# EasyEDA Pro project ProPrj_ESP32 Touchpad.epro, schematic Schematic1

## Sheets
1 ESP32: Assembly Variant: Basic; Board Name: Board1; Create Date: 2025-12-21; Page Name: P1; Project Name: ESP32 Touchpad; Schematic Name: Schematic1; Update Date: 2025-12-21; BladeWidth: 10; Company: 嘉立创EDA; Page Size: A4; RegionStart: 1; ShowBorder: 1; TitleBlock: 1; TitleBlockPosition: 3; Version: V1.0; XRegionCount: 6; YRegionCount: 4
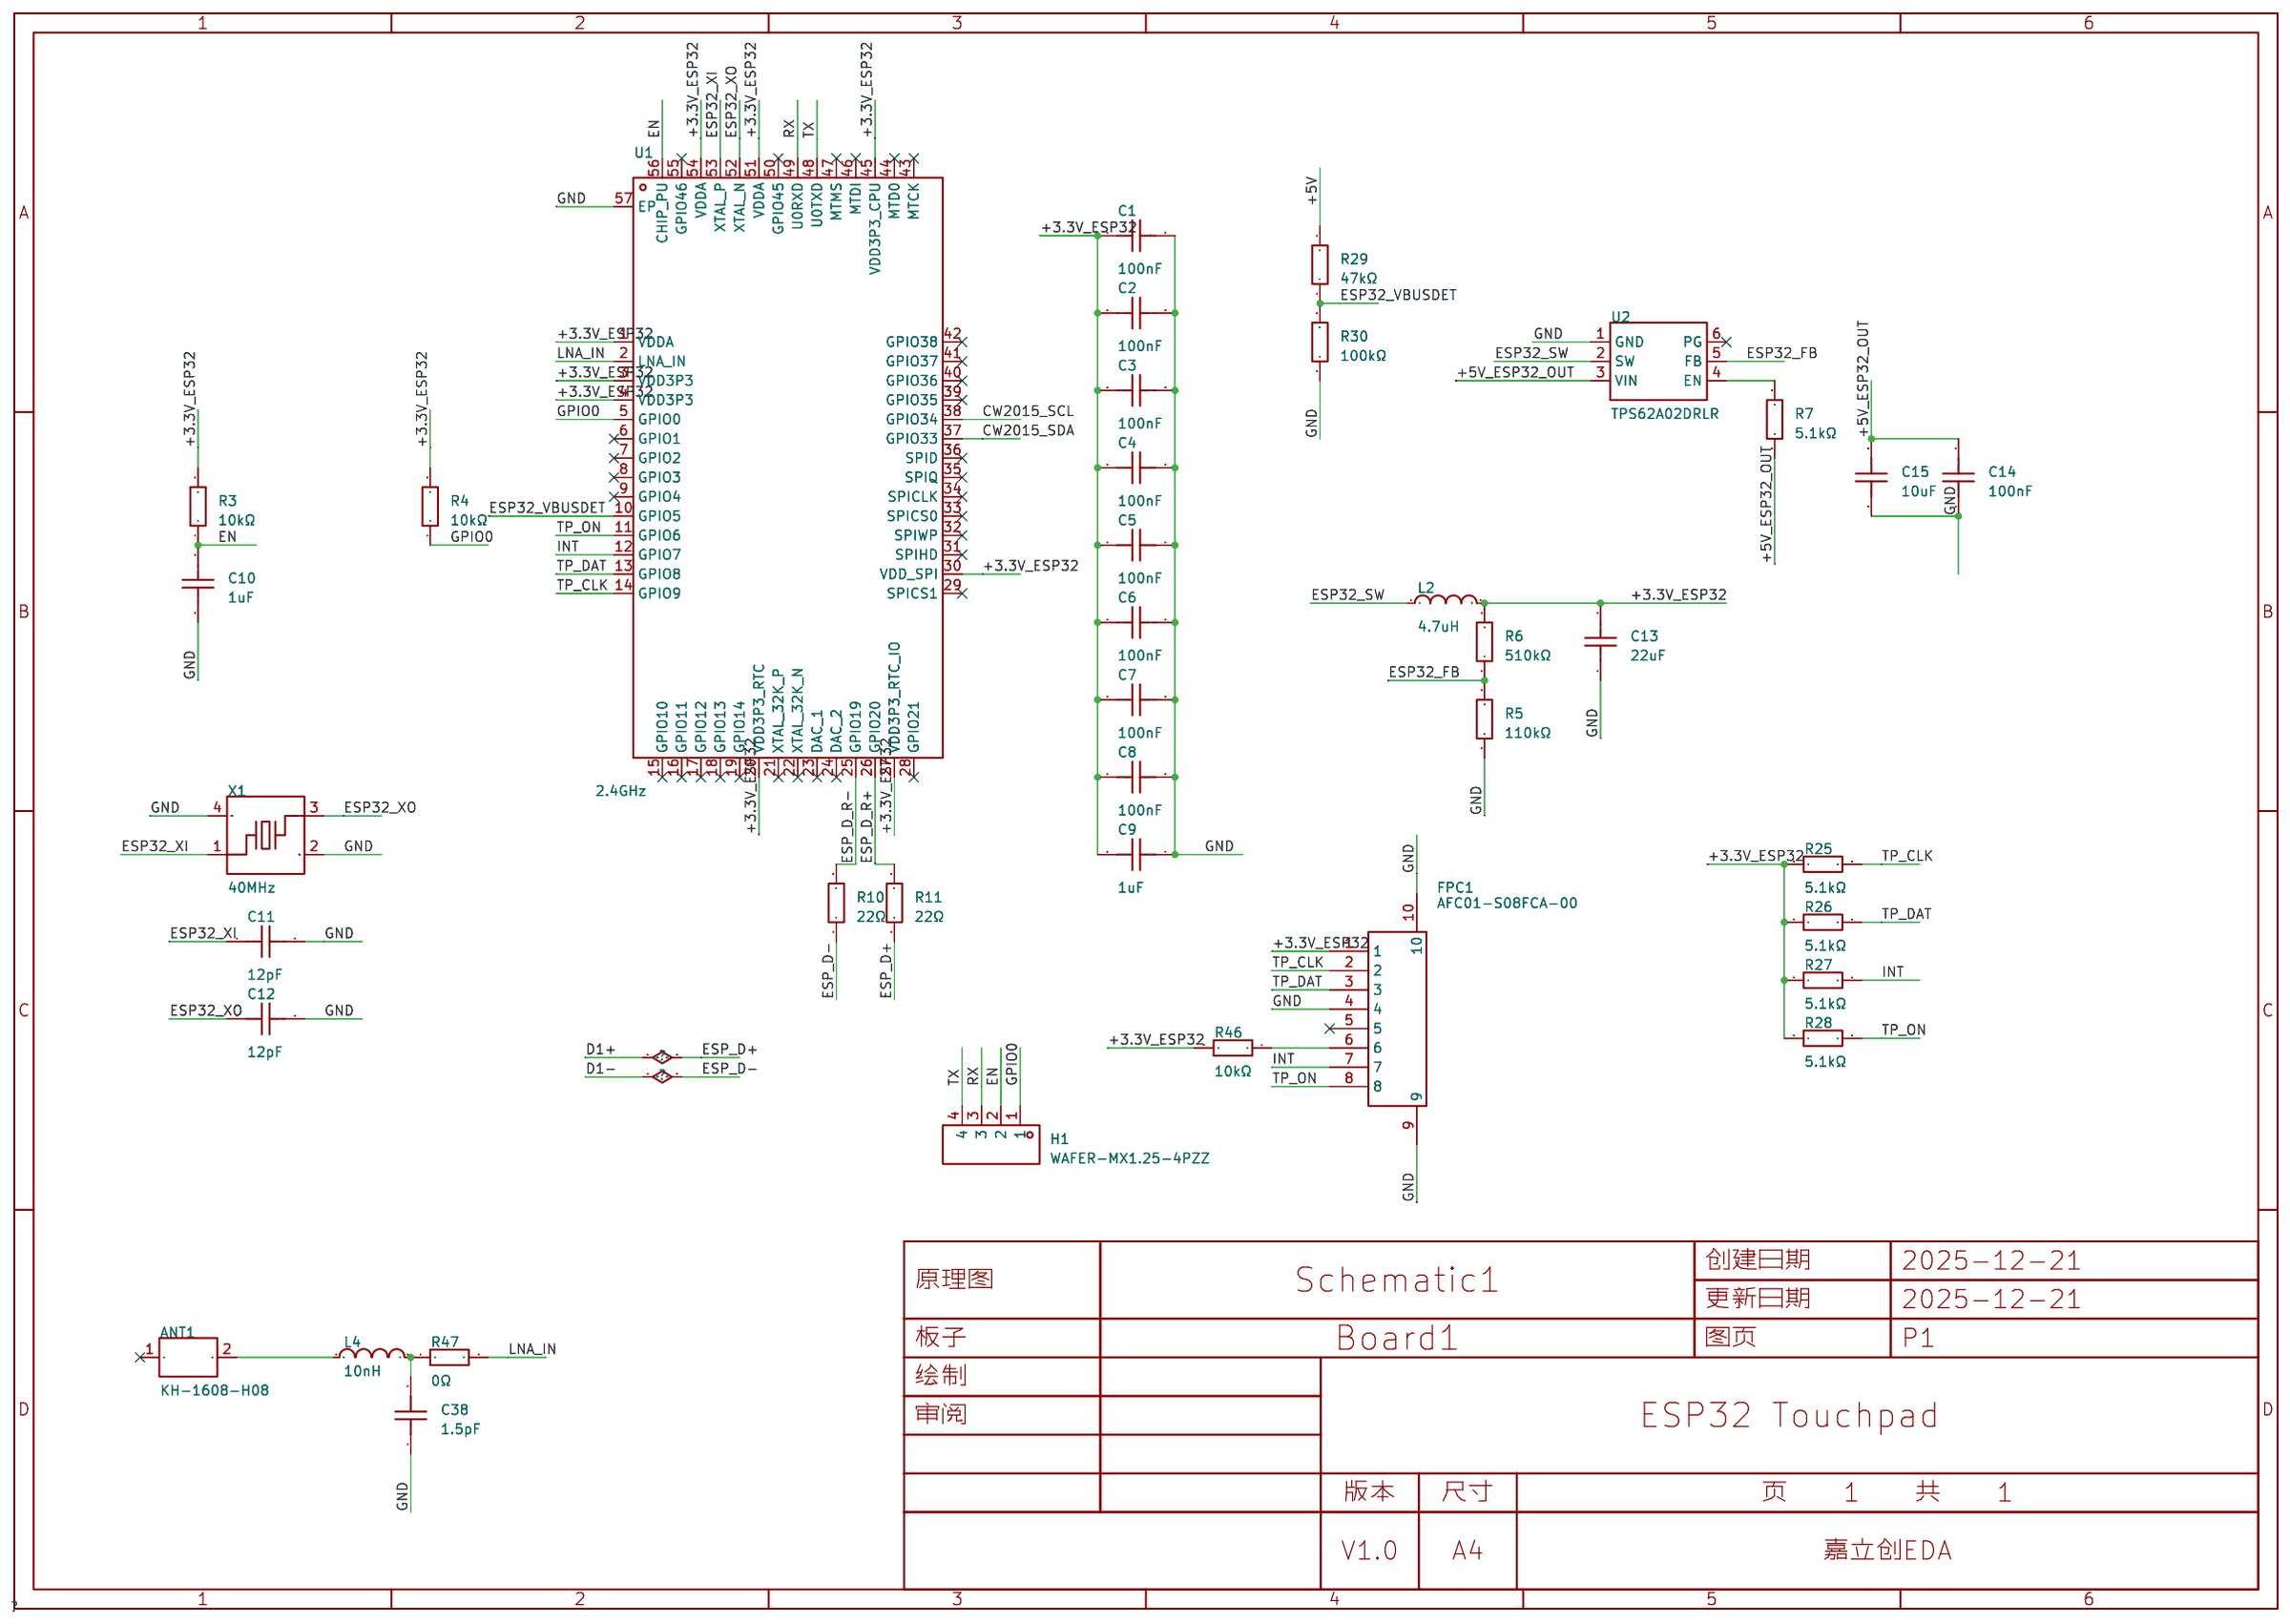
[diagram p1: ESP32]
2 BAT: Create Date: 2026-01-17; Update Date: 2026-01-17
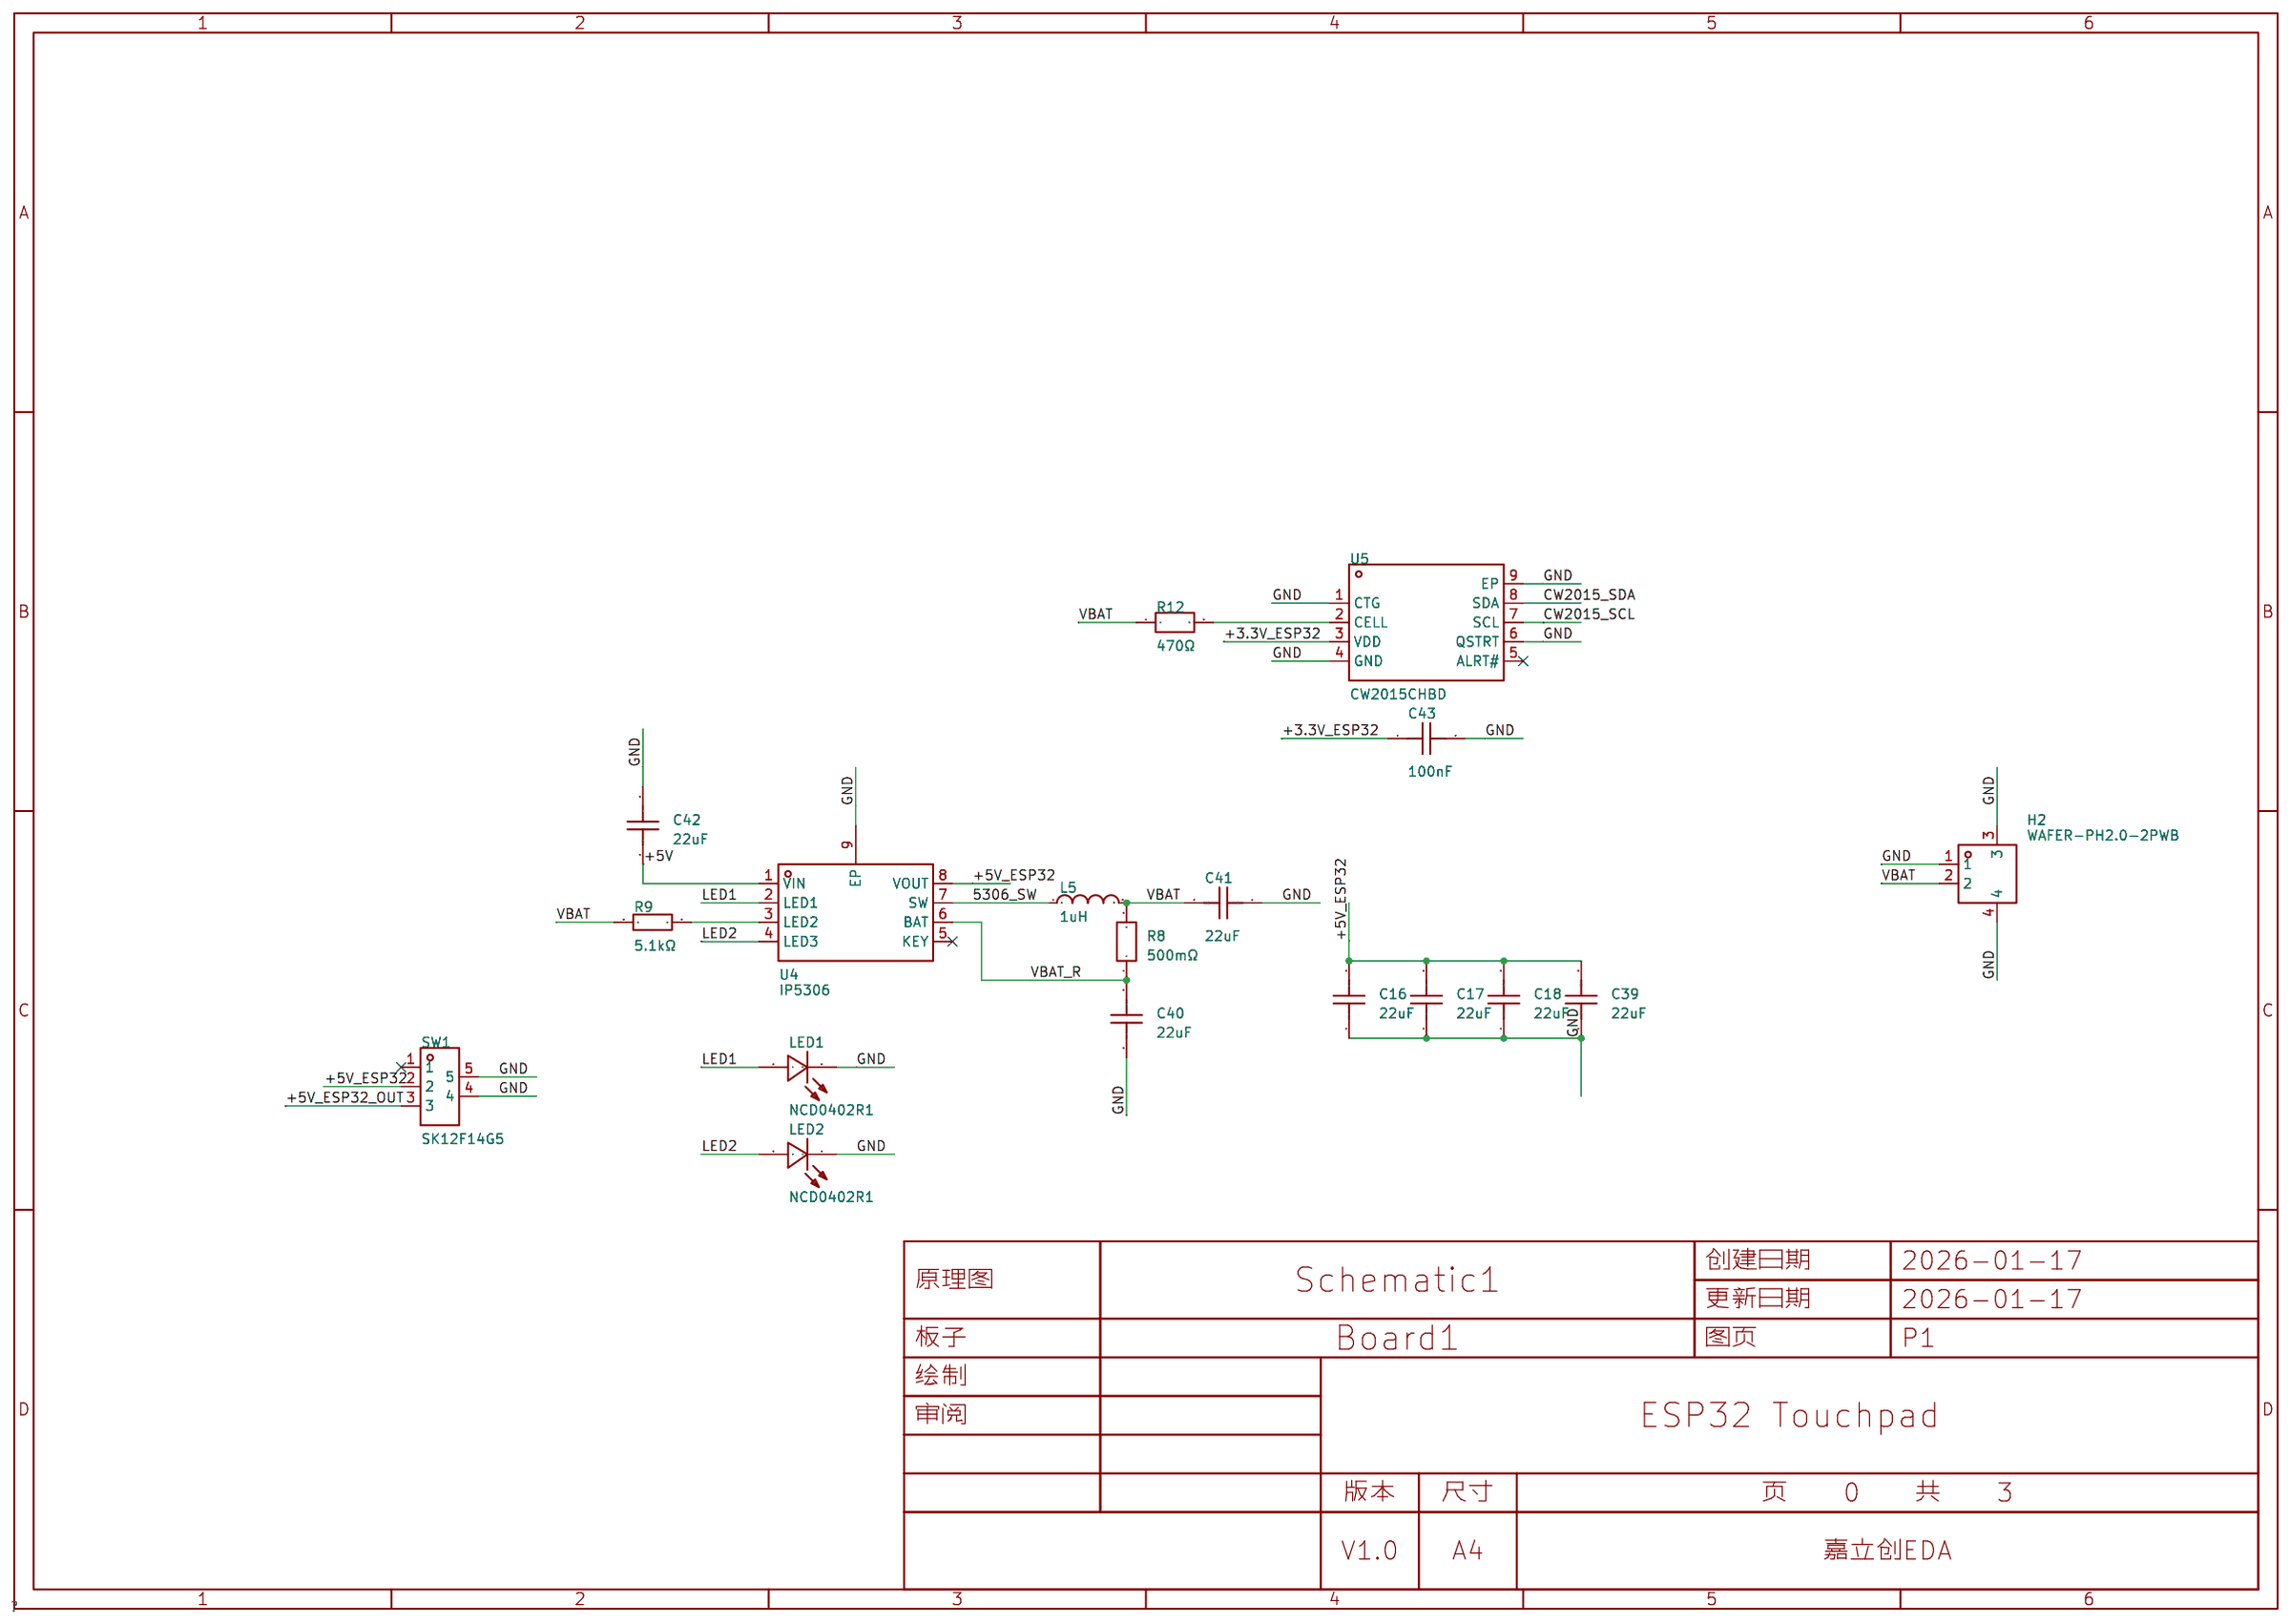
[diagram p2: BAT]
3 USB2513B: Create Date: 2025-12-22; Update Date: 2025-12-22
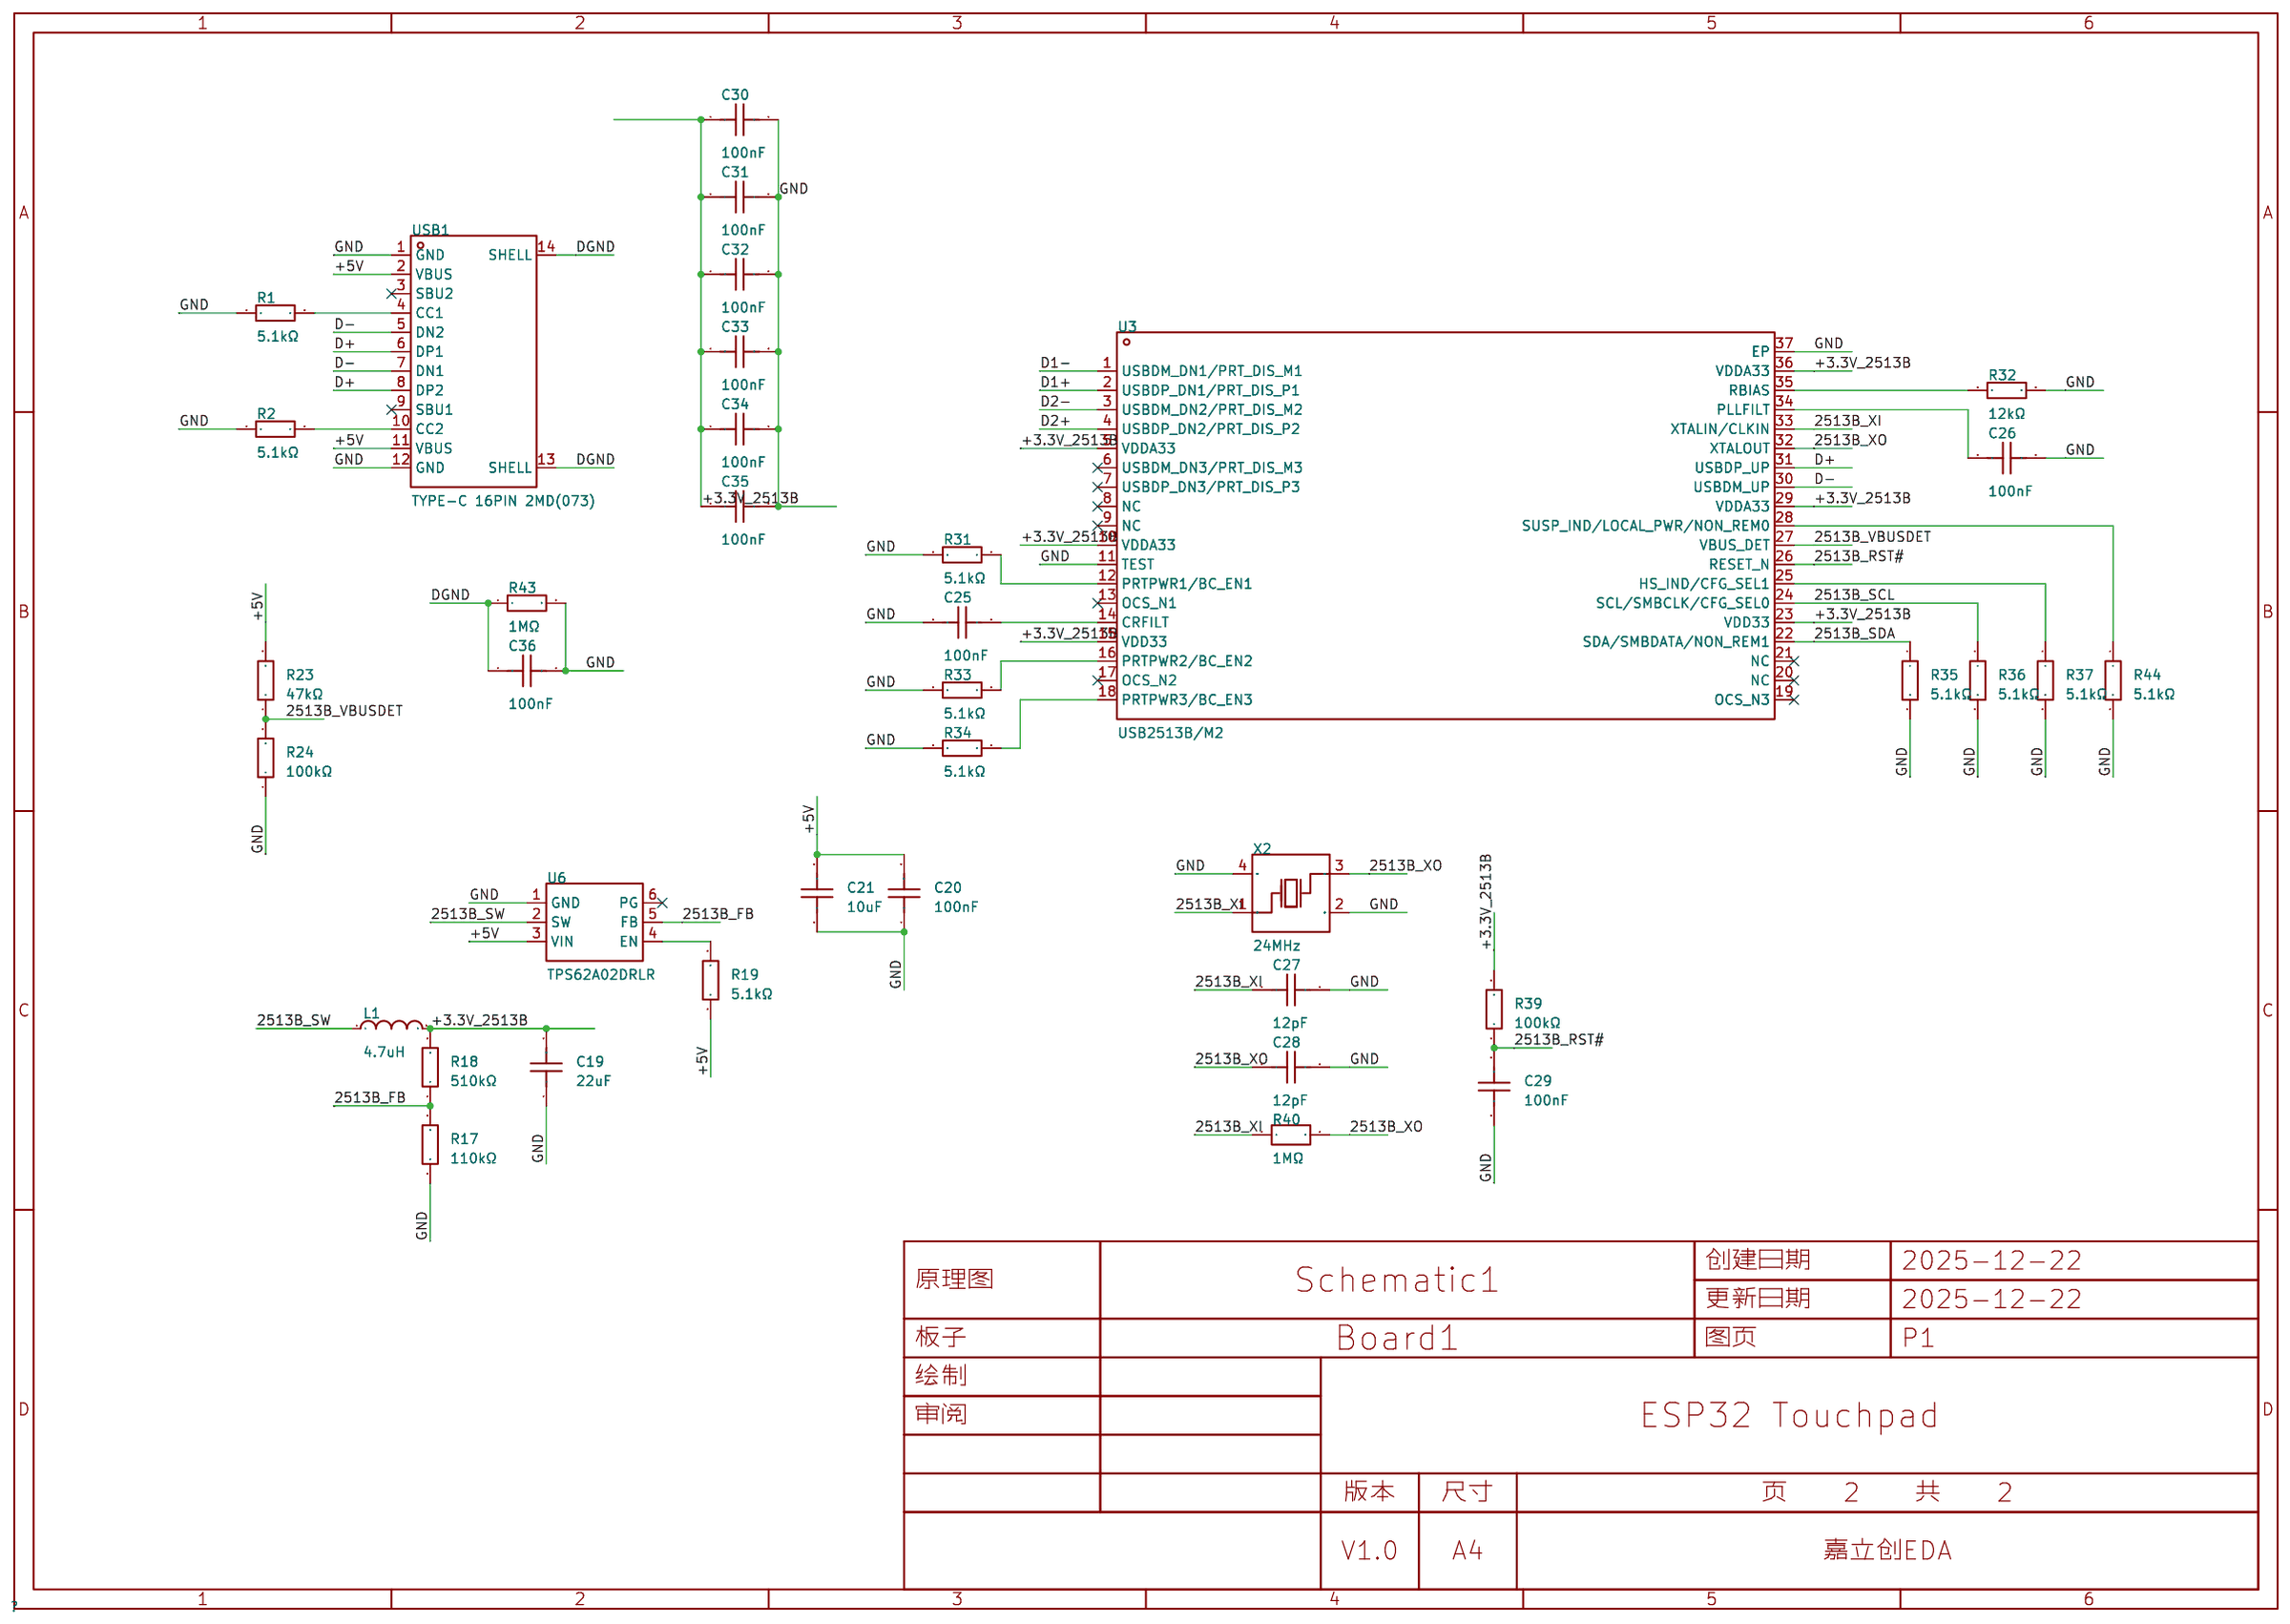
[diagram p3: USB2513B]
4 FM3483_3633: Create Date: 2025-12-22; Page Name: P2; Update Date: 2025-12-22
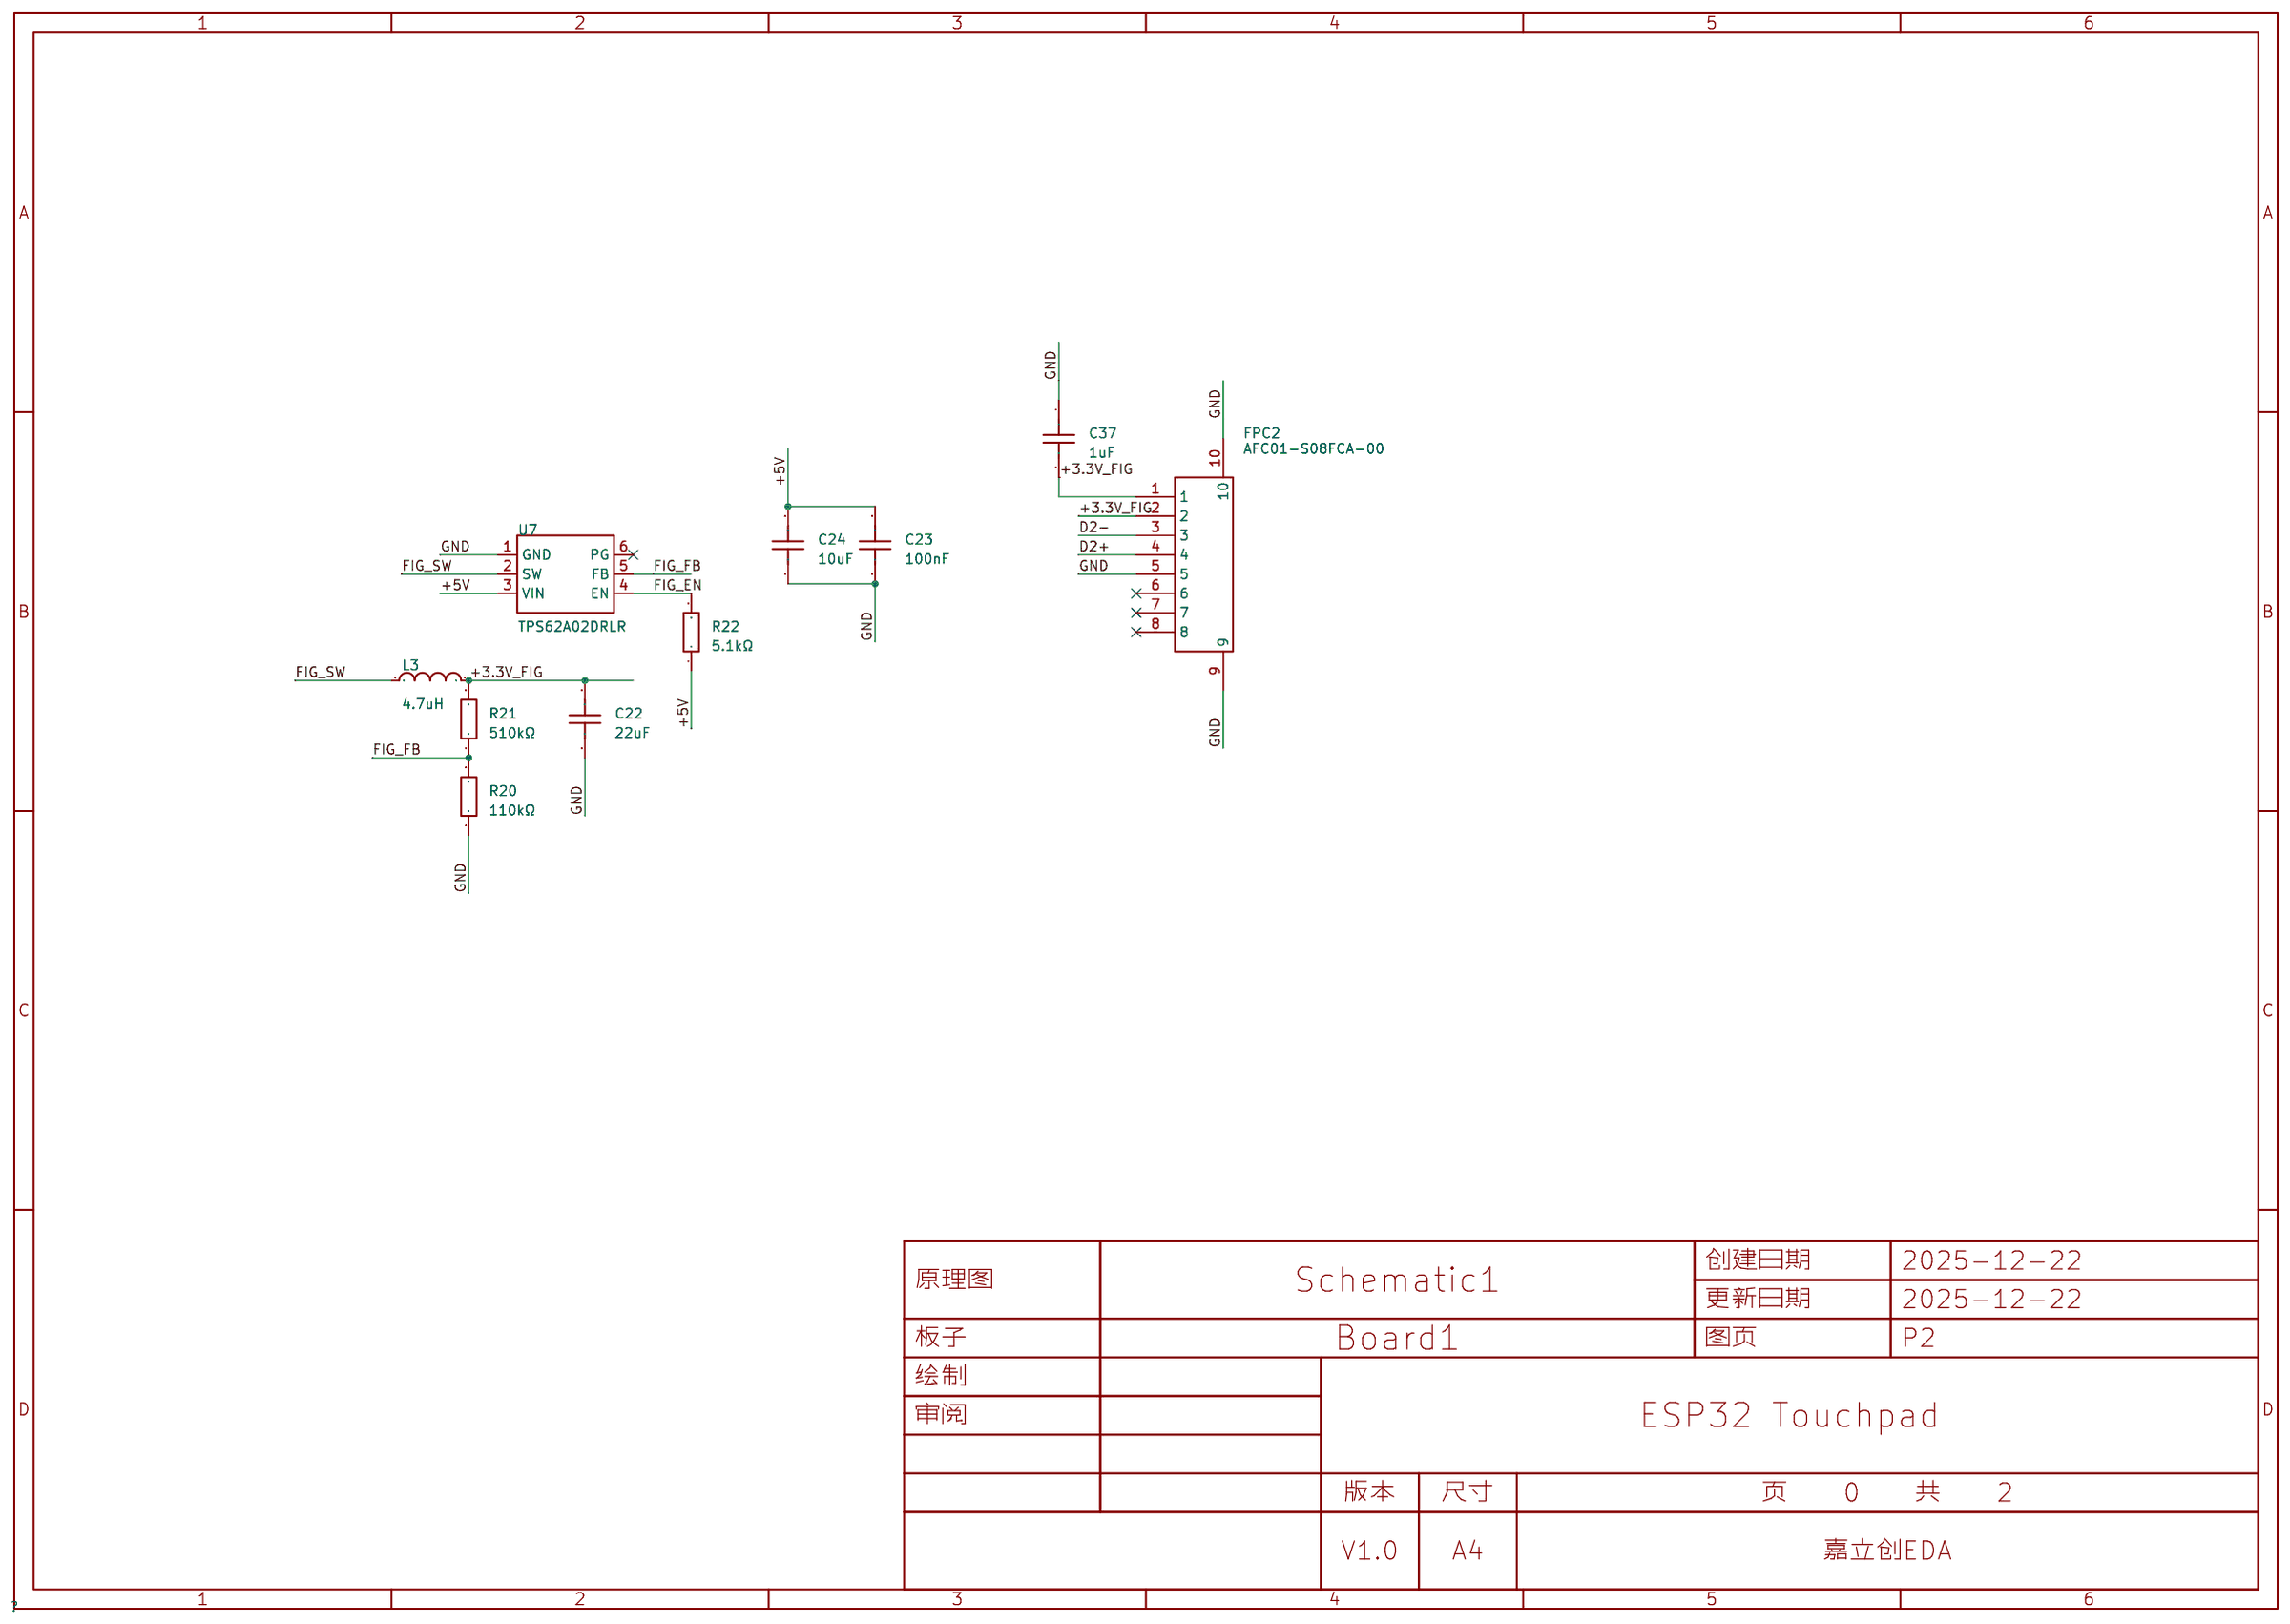
[diagram p4: FM3483_3633]

## Parts
sheet BAT
C16  22uF  [C0402]
C17  22uF  [C0402]
C18  22uF  [C0402]
C39  22uF  [C0402]
C40  22uF  [C0402]
C41  22uF  [C0402]
C42  22uF  [C0402]
C43  100nF  [C0402]
H2  WAFER-PH2.0-2PWB  [CONN-SMD_2P-P2.00_XUNPU_WAFER-PH2.0-2PWB]
L5  1uH  [IND-SMD_L2.5-W2.0-VLS252012CX-150M]
LED1  NCD0402R1  [LED0402-RD]
LED2  NCD0402R1  [LED0402-RD]
R8  500mΩ  [R0603]
R9  5.1kΩ  [R0402]
R12  470Ω  [R0402]
SW1  SK12F14G5  [SW-TH_SK12F14G5]
U4  IP5306  [ESOP-8_L4.9-W3.9-P1.27-LS6.0-BL-EP]
U5  CW2015CHBD  [TDFN-8_L3.0-W2.0-P0.50-BL-EP]
sheet ESP32
ANT1  KH-1608-H08  [ANT-SMD_L1.7-W0.9]
C1  100nF  [C0402]
C2  100nF  [C0402]
C3  100nF  [C0402]
C4  100nF  [C0402]
C5  100nF  [C0402]
C6  100nF  [C0402]
C7  100nF  [C0402]
C8  100nF  [C0402]
C9  1uF  [C0402]
C10  1uF  [C0402]
C11  12pF  [C0201]
C12  12pF  [C0201]
C13  22uF  [C0402]
C14  100nF  [C0402]
C15  10uF  [C0402]
C38  1.5pF  [C0402]
FPC1  AFC01-S08FCA-00  [FPC-SMD_P0.50-8P_FGS-XJ-H2.0]
H1  WAFER-MX1.25-4PZZ  [CONN-TH_4P-P1.25_WAFER-MX1.25-4PZZ]
L2  4.7uH  [IND-SMD_L2.5-W2.0-VLS252012CX-150M]
L4  10nH  [L0402-RD]
R3  10kΩ  [R0402]
R4  10kΩ  [R0402]
R5  110kΩ  [R0402]
R6  510kΩ  [R0402]
R7  5.1kΩ  [R0402]
R10  22Ω  [R0201]
R11  22Ω  [R0201]
R25  5.1kΩ  [R0402]
R26  5.1kΩ  [R0402]
R27  5.1kΩ  [R0402]
R28  5.1kΩ  [R0402]
R29  47kΩ  [R0402_1]
R30  100kΩ  [R0402_1]
R46  10kΩ  [R0402]
R47  0Ω  [R0402_1]
U1  2.4GHz  [QFN-56_L7.0-W7.0-P0.40-TL-EP4.6]
U2  TPS62A02DRLR  [SOT-563_L1.6-W1.2-P0.50-LS1.6-TL]
X1  40MHz  [CRYSTAL-SMD_4P-L1.6-W1.2-BL]
sheet FM3483_3633
C22  22uF  [C0402]
C23  100nF  [C0402]
C24  10uF  [C0402]
C37  1uF  [C0402]
FPC2  AFC01-S08FCA-00  [FPC-SMD_P0.50-8P_FGS-XJ-H2.0]
L3  4.7uH  [IND-SMD_L2.5-W2.0-VLS252012CX-150M]
R20  110kΩ  [R0402]
R21  510kΩ  [R0402]
R22  5.1kΩ  [R0402]
U7  TPS62A02DRLR  [SOT-563_L1.6-W1.2-P0.50-LS1.6-TL]
sheet USB2513B
C19  22uF  [C0402]
C20  100nF  [C0402]
C21  10uF  [C0402]
C25  100nF  [C0402]
C26  100nF  [C0402]
C27  12pF  [C0201]
C28  12pF  [C0201]
C29  100nF  [C0402]
C30  100nF  [C0402]
C31  100nF  [C0402]
C32  100nF  [C0402]
C33  100nF  [C0402]
C34  100nF  [C0402]
C35  100nF  [C0402]
C36  100nF  [C0805]
L1  4.7uH  [IND-SMD_L2.5-W2.0-VLS252012CX-150M]
R1  5.1kΩ  [R0402]
R2  5.1kΩ  [R0402]
R17  110kΩ  [R0402]
R18  510kΩ  [R0402]
R19  5.1kΩ  [R0402]
R23  47kΩ  [R0402_1]
R24  100kΩ  [R0402_1]
R31  5.1kΩ  [R0402]
R32  12kΩ  [R0402]
R33  5.1kΩ  [R0402]
R34  5.1kΩ  [R0402]
R35  5.1kΩ  [R0402]
R36  5.1kΩ  [R0402]
R37  5.1kΩ  [R0402]
R39  100kΩ  [R0402_1]
R40  1MΩ  [R0201]
R43  1MΩ  [R0805]
R44  5.1kΩ  [R0402]
U3  USB2513B/M2  [QFN-36_L6.0-W6.0-P0.50-BL-EP3.9]
U6  TPS62A02DRLR  [SOT-563_L1.6-W1.2-P0.50-LS1.6-TL]
USB1  TYPE-C 16PIN 2MD(073)  [USB-C-SMD_TYPE-C-6PIN-2MD-073]
X2  24MHz  [CRYSTAL-SMD_4P-L3.2-W2.5-BL]

## Library data of the parts
C13 C16-C19 C22 C39-C42 = GRM155R60J226ME11D: 容值:22uF;精度:±20%;额定电压:6.3V;温度系数:X5R;; LCSC Part Name: 22uF ±20% 6.3V; Supplier Part: C415703; Manufacturer: muRata(村田); Supplier Footprint: 0402; JLCPCB Part Class: Extended Part; Datasheet: https://atta.szlcsc.com/upload/public/pdf/source/20200305/C490387_23319AE8C154DEB24C505E6C82A8106A.pdf; Supplier: LCSC; Tolerance: ±20%; Voltage Rating: 6.3V; Temperature Coefficient: X5R
C1-C8 C30-C35 C43 = CC0402KRX7R7BB104: 容值:100nF;精度:±10%;额定电压:16V;材质(温度系数):X7R;; LCSC Part Name: 100nF ±10% 16V; Supplier Part: C60474; Manufacturer: YAGEO(国巨); Supplier Footprint: 0402; JLCPCB Part Class: Extended Part; Datasheet: https://atta.szlcsc.com/upload/public/pdf/source/20211223/9278FD768280B81DDBEF48FA36411A03.pdf; Supplier: LCSC; Tolerance: ±10%; Voltage Rated: 16V; Temperature Coefficient: X7R
H2 = WAFER-PH2.0-2PWB: 插针结构:1x2P;间距:2mm;安装方式:卧贴;参考系列:PH;总PIN数:2P;排数:1;每排PIN数:2;行距:-;额定电流:2A;触头材质:黄铜;触头镀层:锡;工作温度:-25℃~+85℃;; LCSC Part Name: 1x2P 间距:2mm 卧贴 系列:PH; Supplier Part: C3029440; Manufacturer: XUNPU(讯普); Supplier Footprint: SMD,P=2mm,卧贴; JLCPCB Part Class: Extended Part; Datasheet: https://item.szlcsc.com/datasheet/WAFER-PH2.0-2PWB/3561452.html; Supplier: LCSC; Pins Structure: 1x2P; Pitch: 2mm; Mounting Type: 卧贴; Reference Series: PH; Number of Pins: 2P; Number of Rows: 1; Number of PINs Per Row: 2; Current Rating: 2A; Contact Material: 黄铜; Contact Plating: 锡; Operating Temperature: -25℃~+85℃; Voltage Rating: 250V; Plastic Material: LCP; Supplementary Features: 辅助焊脚; Color: 米色; Z-Height of the Board: 5.6mm; X-Length of Bottom Edge on Board (Spacing Line): 8mm; Y-Width of Bottom Edge on Board: 7.59mm
L5 = FTC252012S1R0MBCA: 电感值:1uH;精度:±20%;额定电流:4A;饱和电流(Isat):5.6A;类型:-;; LCSC Part Name: 1uH ±20% 5.6A; Supplier Part: C5832370; Manufacturer: cjiang(长江微电); Supplier Footprint: 1008; JLCPCB Part Class: Extended Part; Datasheet: https://item.szlcsc.com/datasheet/FTC252012S1R0MBCA/6763490.html; Supplier: LCSC; Tolerance: ±20%; Current Rating: 4A; Current - Saturation(Isat): 5.6A; DC Resistance(DCR): 35mΩ
LED1 LED2 = NCD0402R1: 发光颜色:红色;正向电压(VF):1.6V~2.6V;功率:65mW;正向电流:5mA;主波长:615nm~635nm;透镜颜色:无色透明透镜;发光强度:13mcd~30mcd;发光角度:130°;工作温度:-30℃~+85℃;; Supplier Part: C130719; Manufacturer: 国星光电; Supplier Footprint: 0402; JLCPCB Part Class: 扩展库; Datasheet: https://atta.szlcsc.com/upload/public/pdf/source/20200820/C130719_A72EA5A7FEC83C35856EA0453E4EE775.pdf; Supplier: LCSC; Emitted Color: 红色; Forward Voltage (VF): 1.6V~2.6V; Power Dissipation: 65mW; Forward Current: 5mA; Dominant Wavelength: 615nm~635nm; Lens Color: 无色透明透镜; Luminous Intensity: 13mcd~30mcd; Viewing Angle: 130°; Operating Temperature: -30℃~+85℃
R8 = FRL0603JR500TS: 电阻类型:厚膜电阻;阻值:500mΩ;精度:±5%;功率:100mW;工作电压:100V;温度系数:±300ppm/℃;; LCSC Part Name: 500mΩ ±5% 100mW 厚膜电阻; Supplier Part: C2930046; Manufacturer: FOJAN(富捷); Supplier Footprint: 0603; JLCPCB Part Class: Extended Part; Supplier: LCSC; Type: 厚膜电阻; Tolerance: ±5%; Power(Watts): 100mW; Voltage-Supply(Max): 100V; Temperature Coefficient: ±300ppm/℃; Operating Temperature: -55℃~+155℃
R1 R2 R7 R9 R19 R22 R25-R28 R31 R33-R37 R44 = 0402WGF5101TCE: 电阻类型:厚膜电阻;阻值:5.1kΩ;精度:±1%;功率:62.5mW;工作电压:50V;温度系数:±100ppm/℃;; LCSC Part Name: 5.1kΩ ±1% 62.5mW 厚膜电阻; Supplier Part: C25905; Manufacturer: UNI-ROYAL(厚声); Supplier Footprint: 0402; JLCPCB Part Class: Basic Part; Datasheet: https://item.szlcsc.com/datasheet/0402WGF5101TCE/26648.html; Supplier: LCSC; Type: 厚膜电阻; Tolerance: ±1%; Power(Watts): 62.5mW; Voltage-Supply(Max): 50V; Temperature Coefficient: ±100ppm/℃; Operating Temperature: -55℃~+155℃
R12 = FRC0402F4700TS: 电阻类型:厚膜电阻;阻值:470Ω;精度:±1%;功率:62.5mW;工作电压:50V;温度系数:±100ppm/℃;; LCSC Part Name: 470Ω ±1% 62.5mW 厚膜电阻; Supplier Part: C2909361; Manufacturer: FOJAN(富捷); Supplier Footprint: 0402; JLCPCB Part Class: Extended Part; Supplier: LCSC; Type: 厚膜电阻; Tolerance: ±1%; Power(Watts): 62.5mW; Voltage-Supply(Max): 50V; Temperature Coefficient: ±100ppm/℃; Operating Temperature: -55℃~+155℃
SW1 = SK12F14G5: 电路结构:单刀双掷;安装方式:-;开关颜色:-;额定电流:300mA;额定电压:50V;工作寿命:5千次;; Supplier Part: C2887263; Manufacturer: SHOU HAN(首韩); Supplier Footprint: 插件,13.1x5.6mm; JLCPCB Part Class: Extended Part; Datasheet: https://item.szlcsc.com/datasheet/SK12F14G5/3103831.html; Supplier: LCSC; Circuit: 单刀双掷; Termination Style: PC引脚; Length: 13.1mm; Width: 5.6mm; Switch Height: 6.1mm; Current Rating: 300mA; Voltage Rating: 50V; Life: 5千次; Operating Temperature: -10℃~+50℃
U4 = IP5306: 工作电压:4.65V~5.5V;最大充电电流:2.1A;电池类型:锂电池;电池节数:1;; LCSC Part Name: 集成2.1A充电器和2.1A放电器的全集成移动电源系统级芯片; Supplier Part: C181692; Manufacturer: INJOINIC(英集芯); Supplier Footprint: ESOP-8; JLCPCB Part Class: Extended Part; Datasheet: https://item.szlcsc.com/datasheet/IP5306/193089.html; Supplier: LCSC; The Chip Type: 充电芯片；保护芯片; Voltage - Supply: 4.65V~5.5V; Charge Current - Max: 2.1A; Charging Saturation Voltage: 4.2V; End-Off Voltage: 3V; Type of Battery: 锂电池; Number of Cells: 1; Operating Temperature: 0℃~+70℃; Supply Current (Iq): 100uA; Interface: I2C
U5 = CW2015CHBD: 工作电压:2.5V~4.5V;电池节数:1;; LCSC Part Name: 具备低电量状态（SOC）警报功能的低成本电量计 IC; Supplier Part: C881838; Manufacturer: Cellwise(赛微); Supplier Footprint: TDFN-8-EP(2x3); JLCPCB Part Class: Extended Part; Datasheet: https://item.szlcsc.com/datasheet/CW2015CHBD/945357.html; Supplier: LCSC; The Chip Type: 监测芯片; Voltage - Supply: 2.5V~4.5V; Number of Cells: 1; Interface: I2C
ANT1 = KH-1608-H08: 中心频率:2.45GHz;带宽:120MHz;增益:2.28dBi;功率:4W;; Supplier Part: C2925416; Manufacturer: kinghelm(金航标); Supplier Footprint: 0603; JLCPCB Part Class: Extended Part; Datasheet: https://item.szlcsc.com/datasheet/KH-1608-H08/3244678.html; Supplier: LCSC; Frequency(Center/Band): 2.45GHz; Bandwidth: 120MHz; Peak Gain: 2.28dBi; Impedance: 50Ω; Power: 4W; Operating Temperature: -40℃~+110℃; Length: 1.7mm; Width: 0.93mm; Height: 0.75mm
C9 C10 C37 = CL05A105KA5NQNC: 容值:1uF;精度:±10%;额定电压:25V;温度系数:X5R;; LCSC Part Name: 1uF ±10% 25V; Supplier Part: C52923; Manufacturer: SAMSUNG(三星); Supplier Footprint: 0402; JLCPCB Part Class: Basic Part; Datasheet: https://item.szlcsc.com/datasheet/CL05A105KA5NQNC/53938.html; Supplier: LCSC; Tolerance: ±10%; Voltage Rating: 25V; Temperature Coefficient: X5R
C11 C12 C27 C28 = GRM0335C1H120FA01D: 容值:12pF;精度:±1%;额定电压:50V;材质(温度系数):C0G;; LCSC Part Name: 12pF ±1% 50V; Supplier Part: C384960; Manufacturer: muRata(村田); Supplier Footprint: 0201; JLCPCB Part Class: Extended Part; Datasheet: https://atta.szlcsc.com/upload/public/pdf/source/20200724/C384960_E35DB75AD6D4B3E668DE68A9F604D08E.pdf; Supplier: LCSC; Tolerance: ±1%; Voltage Rated: 50V; Temperature Coefficient: C0G
C14 C20 C23 C25 C26 C29 = CL05B104KB54PNC: 容值:100nF;精度:±10%;额定电压:50V;材质(温度系数):X7R;; LCSC Part Name: 100nF ±10% 50V; Supplier Part: C307331; Manufacturer: SAMSUNG(三星); Supplier Footprint: 0402; JLCPCB Part Class: 基础库; Datasheet: https://atta.szlcsc.com/upload/public/pdf/source/20160218/1457707763339.pdf; Supplier: LCSC; Tolerance: ±10%; Voltage Rated: 50V; Temperature Coefficient: X7R
C15 C21 C24 = HGC0402R5106M100NTEJ: 容值:10uF;精度:±20%;额定电压:10V;材质(温度系数):X5R;; LCSC Part Name: 10uF ±20% 10V; Supplier Part: C7472949; Manufacturer: Chinocera(华瓷); Supplier Footprint: 0402; JLCPCB Part Class: Extended Part; Datasheet: https://atta.szlcsc.com/upload/public/pdf/source/20240320/FAC3FEC40A78BC5CCCE96C232A94D860.pdf; Supplier: LCSC; Tolerance: ±20%; Voltage Rated: 10V; Temperature Coefficient: X5R
C38 = GJM1555C1H1R5BB01D: 容值:1.5pF;额定电压:50V;温度系数:C0G;; LCSC Part Name: ±0.1pF 1.5pF 50V; Supplier Part: C76900; Manufacturer: muRata(村田); Supplier Footprint: 0402; JLCPCB Part Class: Extended Part; Datasheet: https://item.szlcsc.com/datasheet/GJM1555C1H1R5BB01D/78027.html; Supplier: LCSC; Voltage Rating: 50V; Temperature Coefficient: C0G
FPC1 FPC2 = AFC01-S08FCA-00: 锁定特性:翻盖式;触点类型:下接;触点数量:8P;间距:0.5mm;安装方式:卧贴;; LCSC Part Name: 间距:0.5mm P数:8P 翻盖式 下接; Supplier Part: C262657; Manufacturer: JS(钜硕电子); Supplier Footprint: SMD,P=0.5mm,卧贴; JLCPCB Part Class: Extended Part; Datasheet: https://item.szlcsc.com/datasheet/AFC01-S08FCA-00/253916.html; Supplier: LCSC; Locking Feature: 翻盖式; Contact Type: 下接; Number of Contacts: 8P; Pitch: 0.5mm; Mounting Type: 卧贴; FFC, FCB Thickness: 0.3mm; Height Above Board: 2mm
H1 = WAFER-MX1.25-4PZZ: 插针结构:1x4P;间距:1.25mm;安装方式:直插;参考系列:PicoBlade(MX 1.25);总PIN数:4P;排数:1;每排PIN数:4;行距:-;额定电流:1A;触头材质:黄铜;触头镀层:-;工作温度:-25℃~+85℃;; LCSC Part Name: 1x4P 间距:1.25mm 直插 系列:PicoBlade(MX 1.25); Supplier Part: C3029397; Manufacturer: XUNPU(讯普); Supplier Footprint: 插件,P=1.25mm; JLCPCB Part Class: 扩展库; Datasheet: https://atta.szlcsc.com/upload/public/pdf/source/20220527/74EE44A637E2E6AE073051F308D41465.pdf; Supplier: LCSC; Pins Structure: 1x4P; Pitch: 1.25mm; Mounting Type: 直插; Reference Series: PicoBlade(MX 1.25); Number of Pins: 4P; Number of Rows: 1; Number of PINs Per Row: 4; Current Rating: 1A; Contact Material: 黄铜; Operating Temperature: -25℃~+85℃; Voltage Rating: 125V; Plastic Material: LCP; Color: 米色; Z-Height of the Board: 4.6mm; Y-Width of Bottom Edge on Board: 3.3mm
L1-L3 = FTC252010S4R7MBCA: 电感值:4.7uH;精度:±20%;额定电流:2A;饱和电流(Isat):2.6A;类型:一体成型电感;; LCSC Part Name: 4.7uH ±20% 2.6A; Supplier Part: C5832360; Manufacturer: cjiang(长江微电); Supplier Footprint: SMD,2x2.5mm; JLCPCB Part Class: 扩展库; Datasheet: https://atta.szlcsc.com/upload/public/pdf/source/20230602/8FFEDA9C0247A92A0D4B67554BFE4091.pdf; Supplier: LCSC; Tolerance: ±20%; Rated Current: 2A; Saturation Current (Isat): 2.6A; DC Resistance (DCR): 160mΩ; Type: 一体成型电感
L4 = LQG15HS10NJ02D: 电感值:10nH;精度:±5%;额定电流:500mA;饱和电流(Isat):-;直流电阻(DCR):260mΩ;; LCSC Part Name: 10nH ±5%; Supplier Part: C77103; Manufacturer: muRata(村田); Supplier Footprint: 0402; JLCPCB Part Class: Extended Part; Datasheet: https://item.szlcsc.com/datasheet/LQG15HS10NJ02D/78230.html; Supplier: LCSC; Tolerance: ±5%; Current Rating: 500mA; DC Resistance(DCR): 260mΩ; Q @ Frequency: 8@100MHz; Frequency - Self Resonant: 3.4GHz
R3 R4 R46 = 0402WGF1002TCE: 电阻类型:厚膜电阻;阻值:10kΩ;精度:±1%;功率:62.5mW;工作电压:50V;温度系数:±100ppm/℃;; LCSC Part Name: 10kΩ ±1% 62.5mW 厚膜电阻; Supplier Part: C25744; Manufacturer: UNI-ROYAL(厚声); Supplier Footprint: 0402; JLCPCB Part Class: Basic Part; Datasheet: https://item.szlcsc.com/datasheet/0402WGF1002TCE/26487.html; Supplier: LCSC; Type: 厚膜电阻; Tolerance: ±1%; Power(Watts): 62.5mW; Voltage-Supply(Max): 50V; Temperature Coefficient: ±100ppm/℃; Operating Temperature: -55℃~+155℃
R5 R17 R20 = RC0402FR-07110KL: 电阻类型:厚膜电阻;阻值:110kΩ;精度:±1%;功率:62.5mW;最大工作电压:50V;温度系数:±100ppm/℃;; LCSC Part Name: 厚膜电阻 110kΩ ±1% 62.5mW; Supplier Part: C138065; Manufacturer: YAGEO(国巨); Supplier Footprint: 0402; JLCPCB Part Class: 扩展库; Datasheet: https://atta.szlcsc.com/upload/public/pdf/source/20181009/C309620_DA5935B6E1D48212CB7A533FE518B3C2.pdf; Supplier: LCSC; Type: 厚膜电阻; Tolerance: ±1%; Power(Watts): 62.5mW; Overload Voltage (Max): 50V; Temperature Coefficient: ±100ppm/℃; Operating Temperature Range: -55℃~+155℃
R6 R18 R21 = RC0402FR-07510KL: 电阻类型:厚膜电阻;阻值:510kΩ;精度:±1%;功率:62.5mW;最大工作电压:50V;温度系数:±100ppm/℃;; LCSC Part Name: 厚膜电阻 510kΩ ±1% 62.5mW; Supplier Part: C137961; Manufacturer: YAGEO(国巨); Supplier Footprint: 0402; JLCPCB Part Class: Extended Part; Datasheet: https://atta.szlcsc.com/upload/public/pdf/source/20181009/C309620_DA5935B6E1D48212CB7A533FE518B3C2.pdf; Supplier: LCSC; Type: 厚膜电阻; Tolerance: ±1%; Power(Watts): 62.5mW; Overload Voltage (Max): 50V; Temperature Coefficient: ±100ppm/℃; Operating Temperature Range: -55℃~+155℃
R10 R11 = 0201WMF220JTEE: 电阻类型:厚膜电阻;阻值:22Ω;精度:±1%;功率:50mW;工作电压:25V;温度系数:±200ppm/℃;; LCSC Part Name: 22Ω ±1% 50mW 厚膜电阻; Supplier Part: C270355; Manufacturer: UNI-ROYAL(厚声); Supplier Footprint: 0201; JLCPCB Part Class: Extended Part; Datasheet: https://item.szlcsc.com/datasheet/0201WMF220JTEE/259885.html; Supplier: LCSC; Type: 厚膜电阻; Tolerance: ±1%; Power(Watts): 50mW; Voltage-Supply(Max): 25V; Temperature Coefficient: ±200ppm/℃; Operating Temperature: -55℃~+155℃
R23 R29 = 0402WGF4702TCE: 电阻类型:厚膜电阻;阻值:47kΩ;精度:±1%;功率:62.5mW;最大工作电压:50V;温度系数:±100ppm/℃;; LCSC Part Name: 47kΩ ±1% 62.5mW 厚膜电阻; Supplier Part: C25792; Manufacturer: UNI-ROYAL(厚声); Supplier Footprint: 0402; JLCPCB Part Class: 基础库; Datasheet: https://atta.szlcsc.com/upload/public/pdf/source/20200306/C422600_1E6D84923E4A46A82E41ADD87F860B5C.pdf; Supplier: LCSC; Type: 厚膜电阻; Tolerance: ±1%; Power(Watts): 62.5mW; Overload Voltage (Max): 50V; Temperature Coefficient: ±100ppm/℃; Operating Temperature Range: -55℃~+155℃
R24 R30 R39 = 0402WGF1003TCE: 电阻类型:厚膜电阻;阻值:100kΩ;精度:±1%;功率:62.5mW;最大工作电压:50V;温度系数:±100ppm/℃;; LCSC Part Name: 100kΩ ±1% 62.5mW 厚膜电阻; Supplier Part: C25741; Manufacturer: UNI-ROYAL(厚声); Supplier Footprint: 0402; JLCPCB Part Class: 基础库; Datasheet: https://atta.szlcsc.com/upload/public/pdf/source/20200306/C422600_1E6D84923E4A46A82E41ADD87F860B5C.pdf; Supplier: LCSC; Type: 厚膜电阻; Tolerance: ±1%; Power(Watts): 62.5mW; Overload Voltage (Max): 50V; Temperature Coefficient: ±100ppm/℃; Operating Temperature Range: -55℃~+155℃
R47 = 0402WGF0000TCE: 电阻类型:厚膜电阻;阻值:0Ω;精度:±1%;功率:62.5mW;最大工作电压:50V;温度系数:±800ppm/℃;; LCSC Part Name: 0Ω ±1% 62.5mW 厚膜电阻; Supplier Part: C17168; Manufacturer: UNI-ROYAL(厚声); Supplier Footprint: 0402; JLCPCB Part Class: 基础库; Datasheet: https://atta.szlcsc.com/upload/public/pdf/source/20200306/C422600_1E6D84923E4A46A82E41ADD87F860B5C.pdf; Supplier: LCSC; Type: 厚膜电阻; Tolerance: ±1%; Power(Watts): 62.5mW; Overload Voltage (Max): 50V; Temperature Coefficient: ±800ppm/℃; Operating Temperature Range: -55℃~+155℃
U1 = ESP32-S2FN4R2: 核心芯片:ESP32-S2芯片;频率:2.4GHz;发射功率:19.5dBm;; Supplier Part: C2844252; Manufacturer: ESPRESSIF(乐鑫); Supplier Footprint: QFN-56-EP(7x7); JLCPCB Part Class: Extended Part; Datasheet: https://item.szlcsc.com/datasheet/ESP32-S2FN4R2/3034621.html; Supplier: LCSC; Utilized IC / Part: ESP32-S2芯片; Interface Type: I2C；GPIO；SPI；PWM；ADC；UART；USB；I2S; Output Power: 19.5dBm
U2 U6 U7 = TPS62A02DRLR: 功能类型:降压型;输出类型:可调;工作电压:2.5V~5.5V;输出电压:600mV~5.5V;输出电流:2A;; Supplier Part: C5350187; Manufacturer: TI(德州仪器); Supplier Footprint: SOT-563; JLCPCB Part Class: 扩展库; Datasheet: https://atta.szlcsc.com/upload/public/pdf/source/20230925/5002998575E271EFC2D789789753E10B.pdf; Supplier: LCSC; Function: 降压型; Output Type: 可调; Voltage - Supply: 2.5V~5.5V; Output Voltage: 600mV~5.5V; Output Current: 2A; Frequency - Switching: 2.4MHz; Operating Temperature: -40℃~+125℃@(TJ); Synchronous Rectifier: 是; Number of Outputs: 1; Topology: 降压式; Switch tube (built-in/external): 内置
X1 = SX0B40.000F1010F30: 晶振类型:贴片晶振;频率:40MHz;常温频差:±10ppm;负载电容:10pF;频率稳定度:±30ppm;; LCSC Part Name: 40MHz ±10ppm 10pF; Supplier Part: C7301927; Manufacturer: SCTF(星通时频); Supplier Footprint: SMD1612-4P; JLCPCB Part Class: 扩展库; Datasheet: https://atta.szlcsc.com/upload/public/pdf/source/20250320/7C567EADEA2F097F6B177D80F84654B3.pdf; Supplier: LCSC; Type: 贴片晶振; Normal temperature Frequency Tolerance: ±10ppm; Load Capacitance: 10pF; Frequency Stability: ±30ppm; Equivalent Series Resistance(ESR): 80Ω; Operating Temperature: -40℃~+85℃
C36 = FCC0805B104K500DT: 容值:100nF;精度:±10%;额定电压:50V;温度系数:X7R;; LCSC Part Name: 100nF ±10% 50V; Supplier Part: C5137467; Manufacturer: FOJAN(富捷); Supplier Footprint: 0805; JLCPCB Part Class: Extended Part; Datasheet: https://item.szlcsc.com/datasheet/FCC0805B104K500DT/5746969.html; Supplier: LCSC; Tolerance: ±10%; Voltage Rating: 50V; Temperature Coefficient: X7R
R32 = 0402WGF1202TCE: 电阻类型:厚膜电阻;阻值:12kΩ;精度:±1%;功率:62.5mW;工作电压:50V;温度系数:±100ppm/℃;; LCSC Part Name: 12kΩ ±1% 62.5mW 厚膜电阻; Supplier Part: C25752; Manufacturer: UNI-ROYAL(厚声); Supplier Footprint: 0402; JLCPCB Part Class: Basic Part; Datasheet: https://item.szlcsc.com/datasheet/0402WGF1202TCE/26495.html; Supplier: LCSC; Type: 厚膜电阻; Tolerance: ±1%; Power(Watts): 62.5mW; Voltage-Supply(Max): 50V; Temperature Coefficient: ±100ppm/℃; Operating Temperature: -55℃~+155℃
R40 = 0201WMF1004TEE: 电阻类型:厚膜电阻;阻值:1MΩ;精度:±1%;功率:50mW;最大工作电压:25V;温度系数:±200ppm/℃;; LCSC Part Name: 1MΩ ±1% 50mW 厚膜电阻; Supplier Part: C473482; Manufacturer: UNI-ROYAL(厚声); Supplier Footprint: 0201; JLCPCB Part Class: 扩展库; Datasheet: https://atta.szlcsc.com/upload/public/pdf/source/20200306/C422600_1E6D84923E4A46A82E41ADD87F860B5C.pdf; Supplier: LCSC; Type: 厚膜电阻; Tolerance: ±1%; Power(Watts): 50mW; Overload Voltage (Max): 25V; Temperature Coefficient: ±200ppm/℃; Operating Temperature Range: -55℃~+155℃
R43 = 0805W8F1004T5E: 电阻类型:厚膜电阻;阻值:1MΩ;精度:±1%;功率:125mW;最大工作电压:150V;温度系数:±100ppm/℃;; LCSC Part Name: 1MΩ ±1% 125mW 厚膜电阻; Supplier Part: C17514; Manufacturer: UNI-ROYAL(厚声); Supplier Footprint: 0805; JLCPCB Part Class: Basic Part; Datasheet: https://atta.szlcsc.com/upload/public/pdf/source/20200306/C422600_1E6D84923E4A46A82E41ADD87F860B5C.pdf; Supplier: LCSC; Type: 厚膜电阻; Tolerance: ±1%; Power(Watts): 125mW; Overload Voltage (Max): 150V; Temperature Coefficient: ±100ppm/℃; Operating Temperature Range: -55℃~+155℃
U3 = USB2513B/M2: Supplier Part: C633337; Manufacturer: MICROCHIP(美国微芯); Supplier Footprint: QFN-36-EP(6x6); JLCPCB Part Class: Extended Part; Datasheet: https://atta.szlcsc.com/upload/public/pdf/source/20180613/C220679_5406C825D415F058D3466663F78F68E9.pdf; Supplier: LCSC; type: 集线器; Protocol: USB 2.0; Supply Voltage: 3.3V; Operating Temperature: 0℃~+85℃
USB1 = TYPE-C 16PIN 2MD(073): 连接器类型:Type-C;协议标准:-;公母:母;安装方式:卧贴;触点数量:16P;端口数量:1;额定电流 - 电源:3A;工作温度:-25℃~+85℃;; LCSC Part Name: Type-C 母 卧贴; Supplier Part: C2765186; Manufacturer: SHOU HAN(首韩); Supplier Footprint: SMD; JLCPCB Part Class: Extended Part; Datasheet: https://item.szlcsc.com/datasheet/TYPE-C%252016PIN%25202MD(073)/2901843.html; Supplier: LCSC; Connector Type: Type-C; Gender: 母; Mounting Type: 卧贴; Number of Contacts: 16P; Number of Ports: 1; Current Rating-Power: 3A; Voltage Rating: 5V; Connect-Disconnect Life: 5千次; Detection color: 黑色; Operating Temperature: -25℃~+85℃
X2 = X322524MOB4SI: 晶振类型:贴片晶振;频率:24MHz;常温频差:±10ppm;负载电容:12pF;频率稳定度:±20ppm;; LCSC Part Name: YSX321SL 24MHZ 4P 3225 12PF ±10PPM -40~85℃ (±20PPM); Supplier Part: C70590; Manufacturer: YXC(扬兴晶振); Supplier Footprint: SMD3225-4P; JLCPCB Part Class: Extended Part; Datasheet: https://item.szlcsc.com/datasheet/X322524MOB4SI/71688.html; Supplier: LCSC; Type: 贴片晶振; Normal temperature Frequency Tolerance: ±10ppm; Load Capacitance: 12pF; Frequency Stability: ±20ppm; Operating Temperature: -40℃~+85℃

## Nets
+3.3V_2513B: C19.2 C30.1 C31.1 C32.1 C33.1 C34.1 C35.1 L1.2 R18.2 R39.2 U3.5(VDDA33) U3.10(VDDA33) U3.15(VDD33) U3.23(VDD33) U3.29(VDDA33) U3.36(VDDA33)
+3.3V_ESP32: C1.1 C2.1 C3.1 C4.1 C5.1 C6.1 C7.1 C8.1 C9.2 C13.2 C43.1 FPC1.1 L2.2 R3.2 R4.2 R6.2 R25.1 R26.1 R27.1 R28.1 R46.2 U1.1(VDDA) U1.3(VDD3P3) U1.4(VDD3P3) U1.20(VDD3P3_RTC) U1.27(VDD3P3_RTC_IO) U1.30(VDD_SPI) U1.45(VDD3P3_CPU) U1.51(VDDA) U1.54(VDDA) U5.3(VDD)
+3.3V_FIG: C22.2 C37.2 FPC2.1 FPC2.2 L3.2 R21.2
+5V: C20.2 C21.2 C23.2 C24.2 C42.1 R19.1 R22.1 R23.2 R29.2 U4.1(VIN) U6.3(VIN) U7.3(VIN) USB1.2(VBUS) USB1.11(VBUS)
+5V_ESP32: C16.2 C17.2 C18.2 C39.2 SW1.2 U4.8(VOUT)
+5V_ESP32_OUT: C14.2 C15.2 R7.1 SW1.3 U2.3(VIN)
DGND: C36.1 R43.1 USB1.13(SHELL) USB1.14(SHELL)
GND: C1.2 C2.2 C3.2 C4.2 C5.2 C6.2 C7.2 C8.2 C9.1 C10.1 C11.2 C12.2 C13.1 C14.1 C15.1 C16.1 C17.1 C18.1 C19.1 C20.1 C21.1 C22.1 C23.1 C24.1 C25.2 C26.1 C27.2 C28.2 C29.1 C30.2 C31.2 C32.2 C33.2 C34.2 C35.2 C36.2 C37.1 C38.1 C39.1 C40.1 C41.1 C42.2 C43.2 FPC1.4 FPC1.9 FPC1.10 FPC2.5 FPC2.9 FPC2.10 H2.1 H2.3 H2.4 LED1.1(K) LED2.1(K) R1.1 R2.1 R5.1 R17.1 R20.1 R24.1 R30.1 R31.2 R32.2 R33.2 R34.2 R35.2 R36.2 R37.2 R43.2 R44.2 SW1.4 SW1.5 U1.57(EP) U2.1(GND) U3.11(TEST) U3.37(EP) U4.9(EP) U5.1(CTG) U5.4(GND) U5.6(QSTRT) U5.9(EP) U6.1(GND) U7.1(GND) USB1.1(GND) USB1.12(GND) X1.2(GND) X1.4(GND) X2.2(GND) X2.4(GND)
VBAT: C41.2 H2.2 L5.2 R8.2 R9.2 R12.1
VBAT_R: C40.2 R8.1 U4.6(BAT)
2513B_FB: R17.2 R18.1 U6.5(FB)
2513B_RST#: C29.2 R39.1 U3.26(RESET_N)
2513B_SCL: R36.1 U3.24(SCL/SMBCLK/CFG_SEL0)
2513B_SDA: R35.1 U3.22(SDA/SMBDATA/NON_REM1)
2513B_SW: L1.1 U6.2(SW)
2513B_VBUSDET: R23.1 R24.2 U3.27(VBUS_DET)
2513B_XI: C27.1 R40.1 U3.33(XTALIN/CLKIN) X2.1(OSC1)
2513B_XO: C28.1 R40.2 U3.32(XTALOUT) X2.3(OSC2)
5306_SW: L5.1 U4.7(SW)
CW2015_SCL: U1.38(GPIO34) U5.7(SCL)
CW2015_SDA: U1.37(GPIO33) U5.8(SDA)
D1+: R11.1 U3.2(USBDP_DN1/PRT_DIS_P1)
D1-: R10.1 U3.1(USBDM_DN1/PRT_DIS_M1)
D2+: FPC2.4 U3.4(USBDP_DN2/PRT_DIS_P2)
D2-: FPC2.3 U3.3(USBDM_DN2/PRT_DIS_M2)
D+: U3.31(USBDP_UP) USB1.6(DP1) USB1.8(DP2)
D-: U3.30(USBDM_UP) USB1.5(DN2) USB1.7(DN1)
EN: C10.2 H1.2 R3.1 U1.56(CHIP_PU)
ESP32_FB: R5.2 R6.1 U2.5(FB)
ESP32_SW: L2.1 U2.2(SW)
ESP32_VBUSDET: R29.1 R30.2 U1.10(GPIO5)
ESP32_XI: C11.1 U1.53(XTAL_P) X1.1
ESP32_XO: C12.1 U1.52(XTAL_N) X1.3
ESP_D_R+: R11.2 U1.26(GPIO20)
ESP_D_R-: R10.2 U1.25(GPIO19)
FIG_EN: R22.2 U7.4(EN)
FIG_FB: R20.2 R21.1 U7.5(FB)
FIG_SW: L3.1 U7.2(SW)
GPIO0: H1.1 R4.1 U1.5(GPIO0)
INT: FPC1.7 R27.2 U1.12(GPIO7)
LED1: LED1.2(A) U4.2(LED1)
LED2: LED2.2(A) U4.4(LED3)
LNA_IN: R47.2 U1.2(LNA_IN)
RX: H1.3 U1.49(U0RXD)
TP_CLK: FPC1.2 R25.2 U1.14(GPIO9)
TP_DAT: FPC1.3 R26.2 U1.13(GPIO8)
TP_ON: FPC1.8 R28.2 U1.11(GPIO6)
TX: H1.4 U1.48(U0TXD)
$1N84: R7.2 U2.4(EN)
$1N120: FPC1.6 R46.1
$1N124: C38.2 L4.2 R47.1
$1N125: ANT1.2 L4.1
$4N3: R2.2 USB1.10(CC2)
$4N4: R1.2 USB1.4(CC1)
$4N71: R19.2 U6.4(EN)
$4N99: R31.1 U3.12(PRTPWR1/BC_EN1)
$4N101: R32.1 U3.35(RBIAS)
$4N109: R34.1 U3.18(PRTPWR3/BC_EN3)
$4N119: R37.1 U3.25(HS_IND/CFG_SEL1)
$4N124: R33.1 U3.16(PRTPWR2/BC_EN2)
$4N152: R44.1 U3.28(SUSP_IND/LOCAL_PWR/NON_REM0)
$5N19: R9.1 U4.3(LED2)
$5N41: R12.2 U5.2(CELL)
Net-(C25-1): C25.1 U3.14(CRFILT)
Net-(C26-2): C26.2 U3.34(PLLFILT)

Not connected (* = marked no-connect by the designer): ANT1 1*; FPC1 5*; FPC2 6* 7* 8*; SW1 1*; U1 6(GPIO1)* 7(GPIO2)* 8(GPIO3)* 9(GPIO4)* 15(GPIO10)* 16(GPIO11)* 17(GPIO12)* 18(GPIO13)* 19(GPIO14)* 21(XTAL_32K_P)* 22(XTAL_32K_N)* 23(DAC_1)* 24(DAC_2)* 28(GPIO21)* 29(SPICS1)* 31(SPIHD)* 32(SPIWP)* 33(SPICS0)* 34(SPICLK)* 35(SPIQ)* 36(SPID)* 39(GPIO35)* 40(GPIO36)* 41(GPIO37)* 42(GPIO38)* 43(MTCK)* 44(MTD0)* 46(MTDI)* 47(MTMS)* 50(GPIO45)* 55(GPIO46)*; U2 6(PG)*; U3 6(USBDM_DN3/PRT_DIS_M3)* 7(USBDP_DN3/PRT_DIS_P3)* 8(NC)* 9(NC)* 13(OCS_N1)* 17(OCS_N2)* 19(OCS_N3)* 20(NC)* 21(NC)*; U4 5(KEY)*; U5 5(ALRT#)*; U6 6(PG)*; U7 6(PG)*; USB1 3(SBU2)* 9(SBU1)*
